# EAGLE design Netzteil (EAGLE 7.2.0)
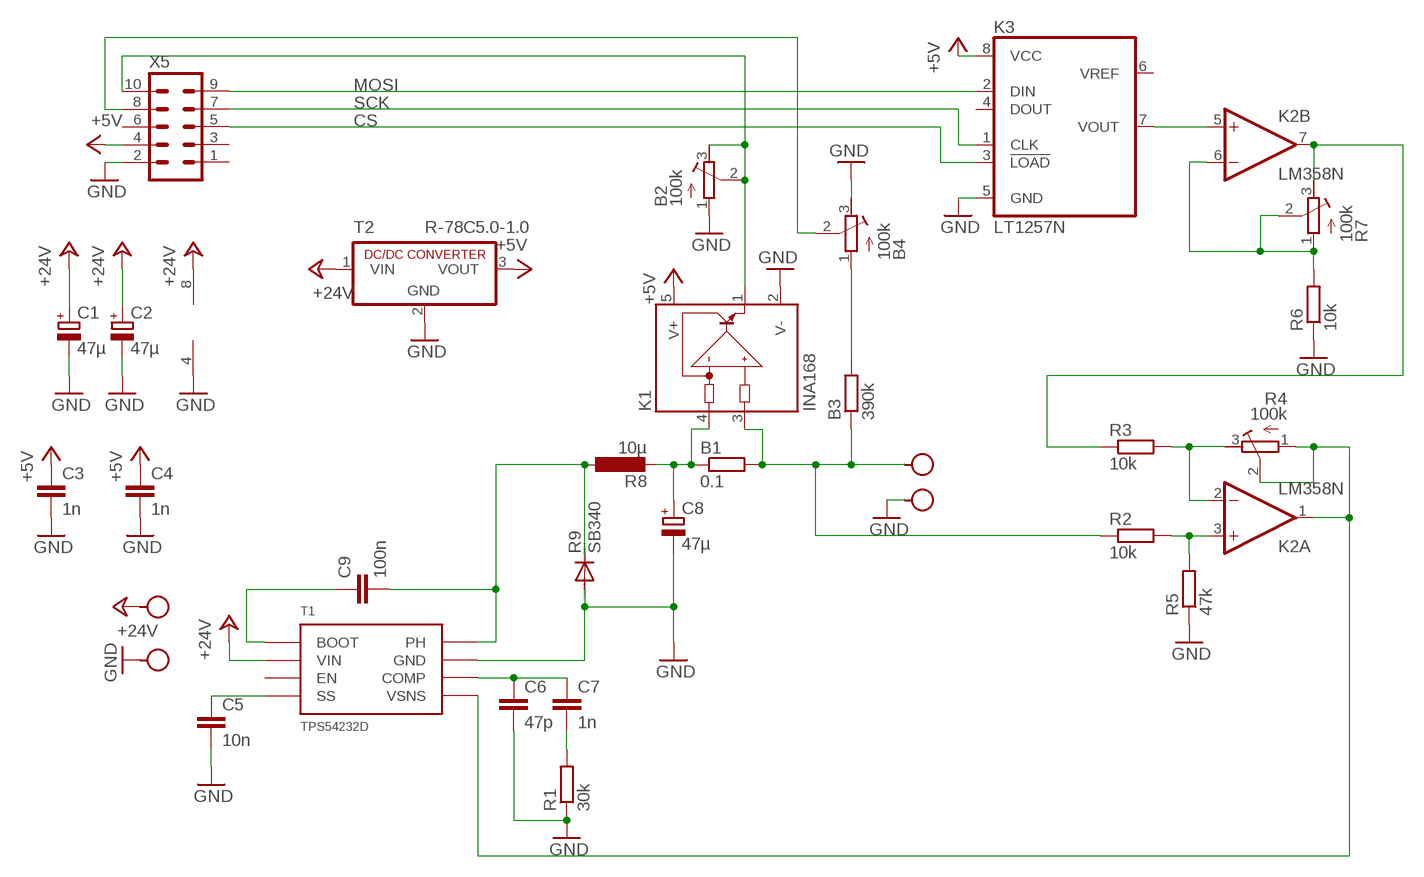
[diagram p0: schematic, sheet 1]

## Parts
B1  0.1  R-EU_0817/22  [P0817/22]
B2  100k  R-TRIMM64Y  [RTRIM64Y]
B3  390k  R-EU_0309/12  [0309/12]
B4  100k  R-TRIMM64Y  [RTRIM64Y]
C1  47µ  CPOL-EUE2.5-6  [E2,5-6]
C2  47µ  CPOL-EUE2.5-6  [E2,5-6]
C3  1n  C-EU025-025X050  [C025-025X050]
C4  1n  C-EU025-025X050  [C025-025X050]
C5  10n  C-EU025-025X050  [C025-025X050]
C6  47p  C-EU025-025X050  [C025-025X050]
C7  1n  C-EU025-025X050  [C025-025X050]
C8  47µ  CPOL-EUE2.5-6  [E2,5-6]
C9  100n  C-EU025-025X050  [C025-025X050]
K1  INA168  [SOT23-5]
K2  LM358N  [DIL08]
K3  LT1257N  [DIL08]
R1  30k  R-EU_0309/12  [0309/12]
R2  10k  R-EU_0309/12  [0309/12]
R3  10k  R-EU_0309/12  [0309/12]
R4  100k  R-TRIMM64Y  [RTRIM64Y]
R5  47k  R-EU_0309/12  [0309/12]
R6  10k  R-EU_0309/12  [0309/12]
R7  100k  R-TRIMM64Y  [RTRIM64Y]
R8  10µ  L-EUPIS2816  [PIS2816]
R9  SB340  SB320  [DO201-15]
T1  TPS54232D  TPS54331DR  [SOIC-8]
T2  R-78C5.0-1.0  [SIP3]
X1  SEW_HOLE-SMALL  [SIMPLE_HOLE_SM]
X2  SEW_HOLE-SMALL  [SIMPLE_HOLE_SM]
X3  SEW_HOLE-SMALL  [SIMPLE_HOLE_SM]
X4  SEW_HOLE-SMALL  [SIMPLE_HOLE_SM]
X5  ML10  [ML10]

## Nets
+5V: C3.1 C4.1 K1.5(V+) K3.8(VCC) T2.3(VOUT) X5.4
+24V [Strom]: C1.+ C2.+ K2.8(P:V+) T1.2(VIN) T2.1(VIN) X1.P$1
CS: K3.3(!LOAD) X5.5
GND: B2.1(E) B4.3(A) C1.- C2.- C3.2 C4.2 C5.2 C6.2 C8.- K1.2(V-) K2.4(P:V-) K3.5(GND) R1.1 R5.1 R6.1 R9.A T1.7(GND) T2.2(GND) X2.P$1 X4.P$1 X5.2
MOSI: K3.2(DIN) X5.9
N$1 [Strom]: B1.1 C8.+ K1.4(IN-) R8.2
N$2 [Strom]: C9.2 R8.1 R9.C T1.8(PH)
N$3: C5.1 T1.4(SS)
N$4: K2.7(B:OUT) R3.1 R7.3(A)
N$5: C7.2 R1.2
N$6 [Strom]: B1.2 B3.1 K1.3(IN+) R2.1 X3.P$1
N$7: C6.1 C7.1 T1.6(COMP)
N$9: B3.2 B4.1(E)
N$10: B4.2(S) X5.8
N$11: K2.1(A:OUT) R4.1(E) R4.2(S) T1.5(VSNS)
N$12: K2.5(B:+IN) K3.7(VOUT)
N$13: K2.6(B:-IN) R6.2 R7.1(E) R7.2(S)
N$14: K2.2(A:-IN) R3.2 R4.3(A)
N$16: K2.3(A:+IN) R2.2 R5.2
N$17: B2.2(S) B2.3(A) K1.1(OUT) X5.10
N$20: C9.1 T1.1(BOOT)
SCK: K3.1(CLK) X5.7
Unconnected: K3.4(DOUT) K3.6(VREF) T1.3(EN) X5.1 X5.3 X5.6

## Library data of the parts
B1 B3 R1-R3 R5 R6 = rcl:R-EU_: RESISTOR, European symbol; OC_FARNELL: unknown
B2 B4 R4 R7 = resistor:R-TRIMM: Trimm resistor
C1 C2 C8 = resistor:CPOL-EU: POLARIZED CAPACITOR, European symbol; OC_FARNELL: unknown
C3-C7 C9 = rcl:C-EU: CAPACITOR, European symbol; OC_FARNELL: unknown
K1 = burr-brown:INA168: High-Side Measurement Current Shunt Monitor; MF: TEXAS INSTRUMENTS; MPN: INA168NA/250; OC_FARNELL: 4375737; OC_NEWARK: 35C1744
K2 = linear:LM358: OP AMP also LM158; LM258; LM2904 Source: http://cache.national.com/ds/LM/LM158.pdf
K3 = linear-technology:LT1257: Complete Single Supply 12-Bit Voltage Output DAC Source: http://www.linear.com/pc/downloadDocument.do?navId=H0,C1,C1155,C1005,C1156,P1425,D3414; OC_FARNELL: unknown; OC_NEWARK: unknown
R8 = rcl:L-EU: INDUCTOR, European symbol
R9 = diode:SB320: DIODE barrier rectifier, 3 A (Fairchild); OC_FARNELL: unknown
T1 = Volks73-TexasInstruments:TPS54331*: DC-DC Converter 3-A, 28-V, Step-Down DC-DC Converter with Eco-Mode™ Documentation Datasheet <http://www.ti.com/lit/ds/symlink/tps54331.pdf> Description The TPS54331 device is a 28-V, 3-A non-synchronous buck converter that integrates a low RDS(on) high-side MOSFET. To increase efficiency at light loads, a pulse skipping Eco-mode feature is automatically activated. Furthermore, the 1-uA shutdown supply current allows the device to be used in battery powered applications. Current mode control with internal slope compensation simplifies the external compensation calculations and reduces component count while allowing the use of ceramic output capacitors. A resistor divider programs the hysteresis of the input under-voltage lockout. An overvoltage transient protection circuit limits voltage overshoots during startup and transient conditions. A cycle-by-cycle current-limit scheme, frequency fold back, and thermal shutdown protect the device and the load in the event of an overload condition. The TPS54331 device is available in 8-pin SOIC package and 8-pin SO PowerPAD package that has been internally optimized to improve thermal performance. Features 3.5 to 28-V Input Voltage Range Adjustable Output Voltage Down to 0.8V Integrated 80-mΩ High-Side MOSFET Supports up to 3-A Continuous Output Current High Efficiency at Light Loads with a Pulse Skipping Eco-mode™ Fixed 1MHz Switching Frequency Typical 1uA Shutdown Quiescent Current Adjustable Slow Start Limits Inrush Currents Programmable UVLO Threshold Overvoltage Transient Protection Cycle-by-Cycle Current-Limit, Frequency Fold Back, and Thermal Shutdown Protection Available in Easy-to-Use SOIC8 Package or Thermally Enhanced 8-Pin SOIC PowerPAD™ Package Supported by WEBENCH <http://www.ti.com/lsds/ti/analog/webench/overview.page>™ Tool (http://www.ti.com/lsds/ti/analog/webench/overview.page) Applications Consumer Applications such as Set-Top Boxes, CPE Equipment, LCB Displays, Peripherals, and Battery Chargers Industrial and Car Audio Power Supplies 5-V, 12-V and 24-V Distributed Power Systems; CATEGORY: Integrated Circuits (ICs); CURRENT-OUTPUT: 3A; DESCRIPTION: IC REG BUCK ADJ 3A 8SOIC; DOCUMENTATION_LINK: <a href="http://www.ti.com/lit/ds/symlink/tps54331.pdf">Datasheet</a>; DOCUMENTATION_URL: http://www.ti.com/lit/ds/symlink/tps54331.pdf; FAMILY: PMIC - Voltage Regulators - DC DC Switching Regulators; FREQUENCY-SWITCHING: 570kHz; MANUFACTURER: Texas Instruments; MOUNTING_TYPE: Surface Mount; NUMBER_OF_OUTPUTS: 1; OPERATING_TEMPERATURE: -40C ~ 150C; OUTPUT_TYPE: Adjustable; PACKAGE: 8-SOIC (0.154", 3.90mm Width); PART_NUMBER: TPS54331DR; SEIRES: Swift, Eco-Mode; SUPPLIER_DEVICE_PACKAGE: 8-SOIC; SUPPLIER_ITEM_LINK: <a href="http://www.digikey.com/product-detail/en/TPS54331DR/296-26991-1-ND/2255284">Details</a>; SUPPLIER_ITEM_NUMBER: 296-26991-1-ND; SUPPLIER_ITEM_URL: http://www.digikey.com/product-detail/en/TPS54331DR/296-26991-1-ND/2255284; SUPPLIER_LINK: <a href="http://www.digikey.com">Home Page</a>; SUPPLIER_NAME: Digi-Key; SUPPLIER_URL: http://www.digikey.com; SYNCHRONOUS_RECTIFIER: No; TYPE: Step-Down (Buck); VOLTAGE-INPUT: 3.5V ~ 28V; VOLTAGE-OUTPUT: 0.8V ~ 25V
T2 = dc-dc-converter:R-78C*-1.0: INNOLINE DC/DC-Converter 1.0 AMP SIP3 Single Output Source: Data sheet <http://www.mikrocontroller.net/attachment/150645/157764-da-01-en-DC_DC_WANDLER_R_78C5_0_1_0.pdf>; MF: RECOM POWER; MPN: R-78C5.0-1.0; OC_FARNELL: 1903040
X1-X4 = LilyPad-Wearables:SEW_HOLE-SMALL: .070" hole with 20mil annular ring; OC_FARNELL: unknown
X5 = con-ml:ML10: HARTING; OC_FARNELL: unknown; OC_NEWARK: unknown

## Net classes
1 Strom: width 0.762 mm

## Board
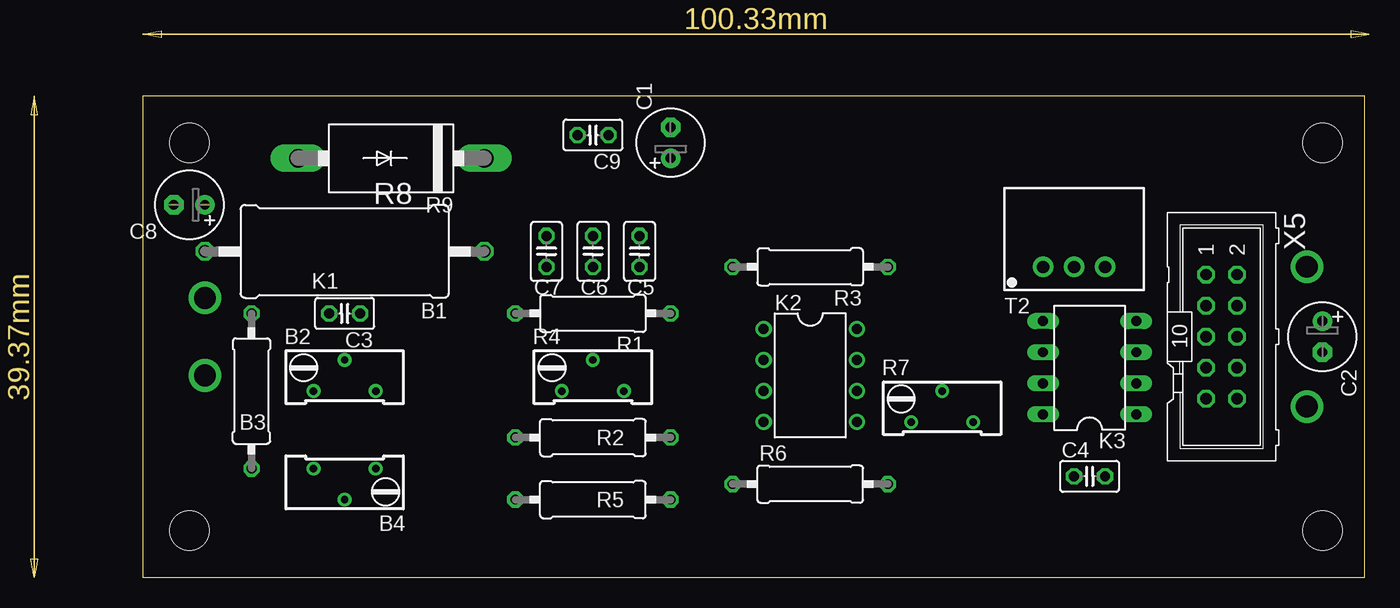
[diagram p1: board, top side]
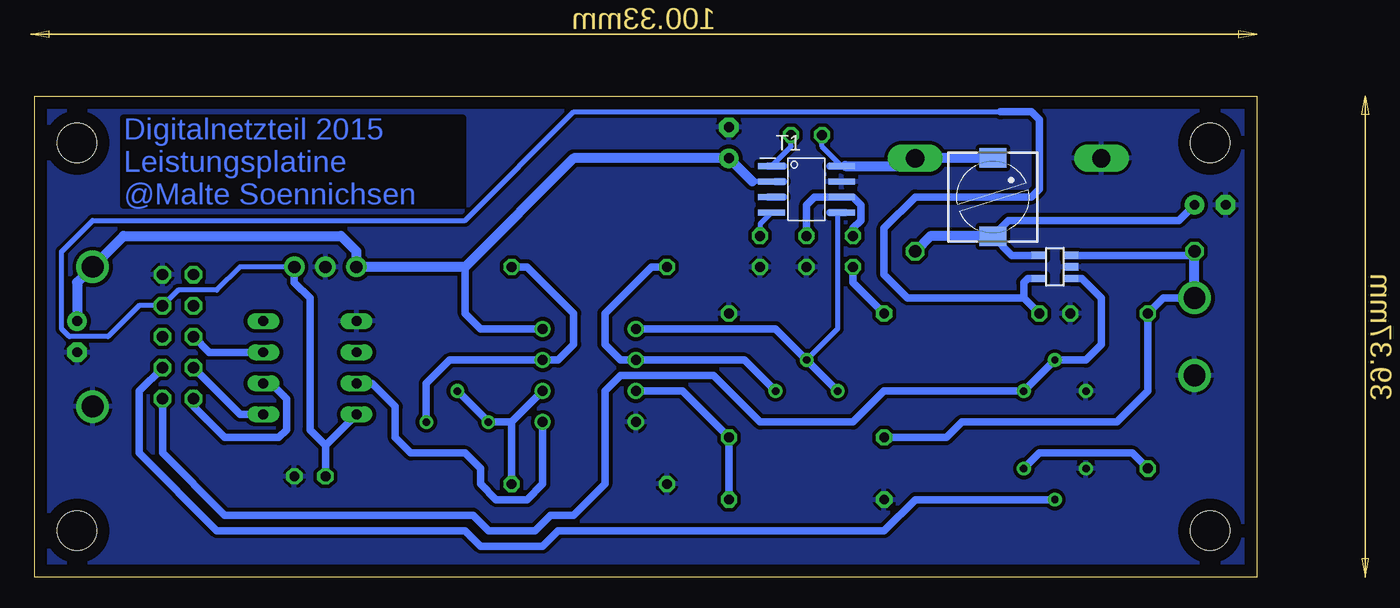
[diagram p2: board, bottom side, seen from below]

Size 100 x 39.36 mm. Coordinates in mm from the lower left corner, seen from the top.
Outline: 0,0 100,0 100,39.36 0,39.36 0,0
Copper layers 16: Bottom 0.035mm
Design rules "default *": minimum track width 12mil, minimum drill 24mil, track to track 12mil, track to pad 12mil, pad to pad 12mil, via to via 12mil, smd to smd 12mil, copper to edge 40mil, drill to drill 8mil, minimum pad ring 10mil, minimum via ring 8mil, stop-mask expansion 4mil, vias tented up to drill 0mil, thermal gap 10mil
Holes 3.2 mm at 3.81,3.81 96.52,3.81 96.52,35.56 3.81,35.56

### Footprints (pad centres in the part's own frame; a part is rotated, then mirrored left to right if it is on the bottom)
P0817/22 = drill 1.016 octagon: 1 -11.43,0; 2 11.43,0
RTRIM64Y = drill 0.61: 1 0,-2.54; 2 -2.54,0; 3 0,2.54
0309/12 = drill 0.813 octagon: 1 -6.35,0; 2 6.35,0
E2,5-6 = drill 0.813 pad 1.6: + -1.27,0 | drill 0.813 pad 1.6 octagon: - 1.27,0
C025-025X050 = drill 0.813 octagon: 1 -1.27,0; 2 1.27,0
SOT23-5 = smd 0.6 x 1.2: 1 -0.95,-1.306; 2 0,-1.306; 3 0.95,-1.306; 4 0.95,1.306; 5 -0.95,1.306
DIL08 = drill 0.813 pad 1.27: 1 -3.81,-3.81; 2 -1.27,-3.81; 3 1.27,-3.81; 4 3.81,-3.81; 5 3.81,3.81; 6 1.27,3.81; 7 -1.27,3.81; 8 -3.81,3.81
DIL08' = drill 0.813 long: 1 -3.81,-3.81; 2 -1.27,-3.81; 3 1.27,-3.81; 4 3.81,-3.81; 5 3.81,3.81; 6 1.27,3.81; 7 -1.27,3.81; 8 -3.81,3.81
PIS2816 = smd 2.2 x 1.6: 1 0,3.2; 2 0,-3.2
DO201-15 = drill 1.499 long: A 7.62,0; C -7.62,0
SOIC-8 = smd 0.5 x 2.2: 1 -1.905,-2.875; 2 -0.635,-2.875; 3 0.635,-2.875; 4 1.905,-2.875; 5 1.905,2.875; 6 0.635,2.875; 7 -0.635,2.875; 8 -1.905,2.875
SIP3 = drill 1 pad 1.676: 1 -2.54,0; 2 0,0; 3 2.54,0
SIMPLE_HOLE_SM = drill 1.778 pad 2.286: P$1 0,0
ML10 = drill 0.914 octagon: 1 -5.08,-1.27; 2 -5.08,1.27; 3 -2.54,-1.27; 4 -2.54,1.27; 5 0,-1.27; 6 0,1.27; 7 2.54,-1.27; 8 2.54,1.27; 9 5.08,-1.27; 10 5.08,1.27

### Placement (x,y rotation side)
B1  16.51,26.67 180 top
B2  16.51,15.24 270 top
B3  8.89,15.24 270 top
B4  16.51,8.89 90 top
C1  43.18,35.56 90 top
C2  96.52,19.68 270 top
C3  16.51,21.59 180 top
C4  77.47,8.26 0 top
C5  40.64,26.67 270 top
C6  36.83,26.67 270 top
C7  33.02,26.67 270 top
C8  3.81,30.48 180 top
C9  36.83,36.2 180 top
K1  16.51,25.4 90 bottom
K2  54.61,16.51 270 top
K3  LT1257N  [DIL08']  77.47,17.14 90 top
R1  36.83,21.59 180 top
R2  36.83,11.43 0 top
R3  54.61,25.4 180 top
R4  36.83,15.24 270 top
R5  36.83,6.35 0 top
R6  54.61,7.62 0 top
R7  65.41,12.7 270 top
R8  21.59,31.11 0 bottom
R9  20.32,34.29 180 top
T1  36.83,31.75 270 bottom
T2  76.2,25.4 0 top
X1  95.25,25.4 90 top
X2  95.25,13.97 90 top
X3  5.08,22.86 90 top
X4  5.08,16.51 90 top
X5  88.27,19.68 270 top

### Tracks (layer width: path | path; a pad name or v marks a point on that pad's centre or on a via)
+5V
  Bottom 0.406: T2.3 83.19,25.4 85.09,23.5 88.27,23.5 X5.4 91.44,22.23 93.98,19.68 97.16,19.68 97.79,20.32 97.79,26.67 95.25,29.21 64.77,29.21 55.88,38.1 20.95,38.1
  Bottom 0.61: 19.05,22.86 19.05,24.13 18.73,24.45 K1.5 | 19.05,22.86 C3.1 | 19.05,22.86 28.57,22.86 30.48,24.77 30.48,28.57 27.94,31.11 18.41,31.11 17.78,31.75 17.78,37.47 18.41,38.1 20.95,38.1 | K3.8 76.2,10.79 | 76.2,10.79 C4.1 | T2.3 78.74,24.13 77.47,22.86 77.47,12.06 76.2,10.79
+24V
  Bottom 0.406: T1.2 41.27,32.38
  Bottom 0.61: K2.8 63.5,20.32 64.77,21.59 64.77,25.4
  Bottom 0.813: C2.+ 96.52,24.13 X1.P$1 92.71,27.94 74.93,27.94 73.66,26.67 T2.1 64.77,25.4 55.88,34.29 C1.+ 41.27,32.38
CS
  Bottom 0.61: K3.3 85.72,18.41 X5.5
GND
  pour Bottom (isolate 0.305): 0,39.37 100.33,39.37 100.33,0 0,0
MOSI
  Bottom 0.61: K3.2 80.64,15.88 79.38,14.61 79.38,12.06 80.01,11.43 84.45,11.43 87,13.97 X5.9
N$1
  Bottom 0.61: K1.4 20.02,26.35 R8.2 20.3,29.21 6.35,29.21 C8.+
  Bottom 0.813: R8.2 26.7,27.91 B1.1
N$2
  Bottom 0.406: T1.8 35.56,35.26 C9.2
  Bottom 0.61: 33.66,33.66 T1.8 34.92,33.66
  Bottom 0.813: 33.66,33.66 28.57,33.66 R9.C 26.7,34.31 R8.1
N$3
  Bottom 0.406: T1.4 40.64,28.91 C5.1
N$4
  Bottom 0.61: R7.3 67.94,15.88 66.04,17.78 K2.7 57.15,17.78 55.88,19.05 55.88,21.59 59.69,25.4 R3.1
N$5
  Bottom 0.61: C7.2 33.02,24.13 R1.2
N$6
  Bottom 0.61: K1.3 5.4,26.35 B1.2 | X3.P$1 7.62,22.86 B3.1 8.89,15.24 11.43,12.7 24.13,12.7 25.4,11.43 R2.1
  Bottom 0.813: X3.P$1 B1.2
N$7
  Bottom 0.61: C7.1 33.02,28.57 32.38,29.21 32.38,30.48 33.02,31.11 T1.6 36.2,31.11 36.83,30.48 C6.1
N$9
  Bottom 0.61: B3.2 10.16,10.16 17.78,10.16 B4.1
N$10
  Bottom 0.61: X5.8 91.44,15.24 91.44,10.16 85.09,3.81 64.77,3.81 63.5,2.54 58.42,2.54 57.15,3.81 30.48,3.81 27.94,6.35 B4.2
N$11
  Bottom 0.406: 34.29,29.84 34.29,20.32 R4.2
  Bottom 0.61: R4.1 R4.2 39.37,20.32 K2.1 | 34.92,29.84 34.29,29.84 T1.5 33.66,29.84
N$12
  Bottom 0.61: K2.5 58.42,7.62 59.69,6.35 62.23,6.35 63.5,7.62 63.5,8.89 64.77,10.16 69.22,10.16 70.48,11.43 70.48,13.97 72.39,15.88 K3.7
N$13
  Bottom 0.61: K2.6 60.96,12.7 | 60.96,12.7 R7.1 R7.2 | R6.2 60.96,12.7
N$14
  Bottom 0.61: R4.3 41.91,17.78 K2.2 52.07,17.78 53.34,19.05 53.34,21.59 49.53,25.4 R3.2
N$15
  Bottom 0.61: 38.73,31.11 40.01,31.11
N$16
  Bottom 0.61: R5.2 R2.2 46.99,15.24 K2.3
N$17
  Bottom 0.61: K1.1 14.29,24.45 12.7,22.86 12.7,19.05 13.97,17.78 B2.2 B2.3 30.48,15.24 33.02,12.7 40.64,12.7 44.45,16.51 52.07,16.51 53.34,15.24 53.34,7.62 55.88,5.08 57.78,5.08 59.05,3.81 62.87,3.81 64.14,5.08 84.45,5.08 89.53,10.16 X5.10
N$18
  Bottom 0.61: 38.73,32.38 39.37,32.38
N$19
  Bottom 0.61: 38.73,33.66 40.01,33.66
N$20
  Bottom 0.406: T1.1 38.1,35.26 C9.1
SCK
  Bottom 0.61: K3.1 83.19,13.34 X5.7

### Text on the board
Bottom: Digitalnetzteil 2015 / Leistungsplatine / @Malte Soennichsen